# EAGLE design Rev1 (EAGLE 6.5.0)
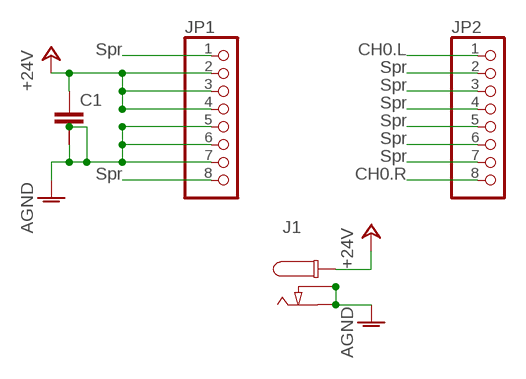
[diagram p0: schematic, sheet 1]

## Parts
C1  C-2.5-5/6  [C2.5/5-6]
J1  CON_DC_M-DC_PTH  [DC_BARREL_JACK_PTH_2MM]
JP1  PINHD-1X8  [1X08]
JP2  PINHD-1X8  [1X08]

## Nets
+24V: C1.1 J1.P1 JP1.2 JP1.3 JP1.4
AGND: C1.2 C1.3 J1.P2(P3) J1.P3(P2) JP1.5 JP1.6 JP1.7
CH0.L: JP2.1
CH0.R: JP2.8
JP1-P1: JP1.1
JP1-P2: JP1.8
JP2-P2: JP2.2
JP2-P3: JP2.3
JP2-P4: JP2.4
JP2-P5: JP2.5
JP2-P6: JP2.6
JP2-P7: JP2.7

## Notes on the sheet
- Spr | CH0.L
- Spr
- Spr
- Spr
- Spr
- Spr
- Spr
- Spr | CH0.R

## Library data of the parts
C1 = capacitor-wima:C-: CAPACITOR for alternative placement naming: default grid - extended grid/package width
J1 = dp_devices.v6:CON_DC_M: DC power connector
JP1 JP2 = pinhead+:PINHD-1X8: PIN HEADER

## Board
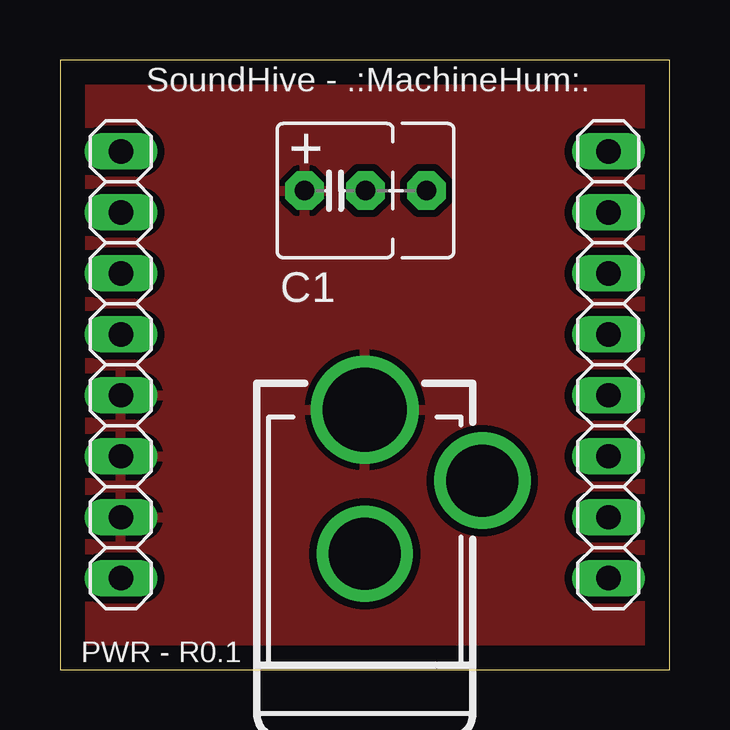
[diagram p1: board, top side]
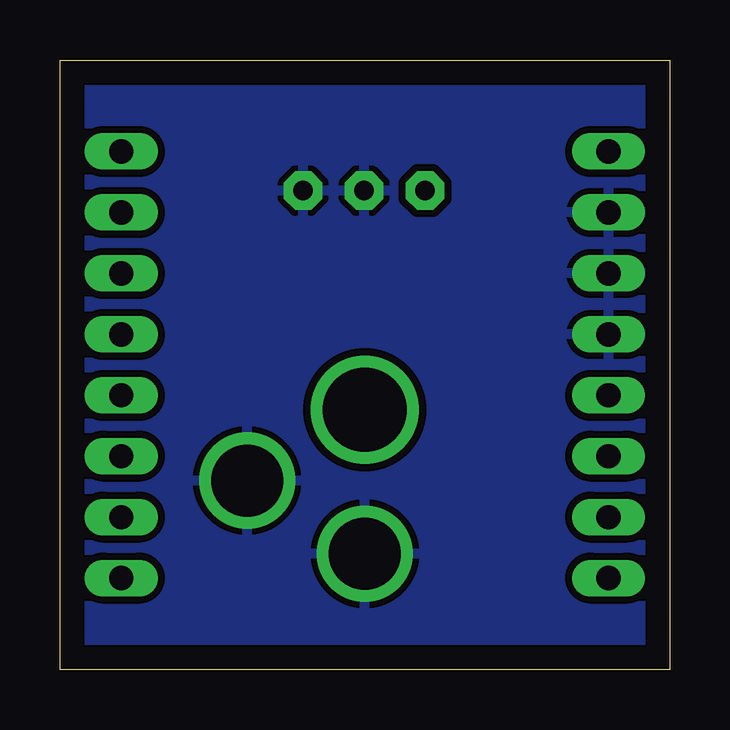
[diagram p2: board, bottom side, seen from below]

Size 25.4 x 25.4 mm. Coordinates in mm from the lower left corner, seen from the top.
Outline: 0,0 25.4,0 25.4,25.4 0,25.4 0,0
Copper layers (1*16): Top 0.035mm / dielectric 1.5mm / Bottom 0.035mm
Design rules "default": minimum track width 10mil, minimum drill 24mil, track to track 8mil, track to pad 8mil, pad to pad 8mil, via to via 8mil, smd to smd 8mil, copper to edge 40mil, drill to drill 8mil, minimum pad ring 10mil, minimum via ring 8mil, stop-mask expansion 4mil, vias tented up to drill 0mil, thermal gap 10mil

### Footprints (pad centres in the part's own frame; a part is rotated, then mirrored left to right if it is on the bottom)
C2.5/5-6 = drill 0.813 pad 1.6 octagon: 1 -1.27,0; 2 1.27,0; 3 3.81,0
DC_BARREL_JACK_PTH_2MM = drill 3.5: P1 0,6.475 | drill 3: P2 4.9,3.525; P3 0,0.475
1X08 = drill 1.016 long: 1 -8.89,0; 2 -6.35,0; 3 -3.81,0; 4 -1.27,0; 5 1.27,0; 6 3.81,0; 7 6.35,0; 8 8.89,0

### Placement (x,y rotation side)
C1  11.46,19.96 0 top
J1  12.7,4.35 0 top
JP1  2.54,12.7 90 top
JP2  22.85,12.7 90 top

### Tracks (layer width: path | path; a pad name or v marks a point on that pad's centre or on a via)
+24V
  pour Top (isolate 0.305): 0,0 0,25.4 25.4,25.4 25.4,0
AGND
  pour Bottom (isolate 0.305): 0,0 0,25.4 25.4,25.4 25.4,0

### Text on the board
tPlace: SoundHive - .:MachineHum:. | + | PWR - R0.1